# Altium project SOT-23,SOT-28,SOD-123.PrjPcb
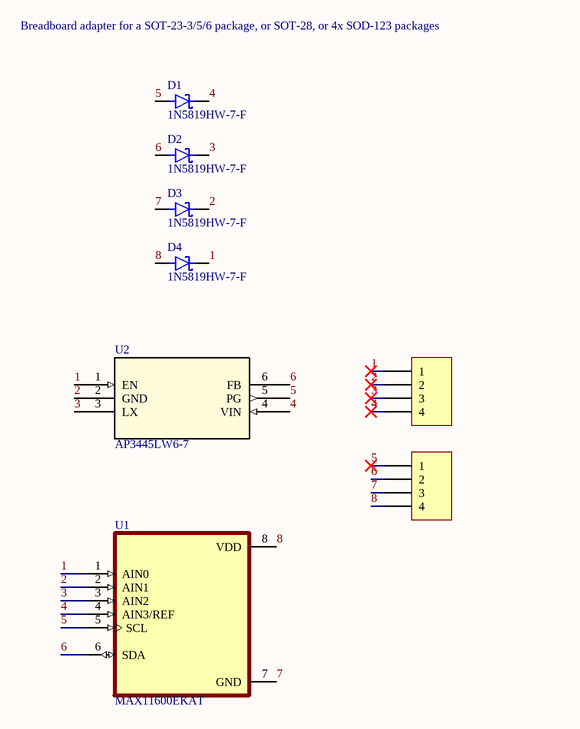
[diagram p0: Schematic.SchDoc]
1 sheet, 8 parts. Net scope: global (net labels, ports and power ports of the same name join across sheets).
Board file: PCB.PcbDoc

## Sheet Schematic.SchDoc
size A4

### Parts
D1  1N5819HW-7-F  [SOD3715X145N]
D2  1N5819HW-7-F  [SOD3715X145N]
D3  1N5819HW-7-F  [SOD3715X145N]
D4  1N5819HW-7-F  [SOD3715X145N]
P1  Header 4  [HDR1X4]  (value not drawn)
P2  Header 4  [HDR1X4]  (value not drawn)
U1  MAX11600EKAT  [SOT65P280X145-8N]
U2  AP3445LW6-7  [SOT26_AP3445_DIO]

### Nets
1: D4.C(K) P1.1 U1.1(AIN0) U2.1(EN)
2: D3.C(K) P1.2 U1.2(AIN1) U2.2(GND)
3: D2.C(K) P1.3 U1.3(AIN2) U2.3(LX)
4: D1.C(K) P1.4 U1.4(AIN3/REF) U2.4(VIN)
5: D1.A P2.1 U1.5(SCL) U2.5(PG)
6: D2.A P2.2 U1.6(SDA) U2.6(FB)
7: D3.A P2.3 U1.7(GND)
8: D4.A P2.4 U1.8(VDD)

### Notes on the sheet
- Breadboard adapter for a SOT-23-3/5/6 package, or SOT-28, or 4x SOD-123 packages

### Library data of the parts
D1-D4 = 1N5819HW-7-F: Diode Schottky 40 V 1A Surface Mount SOD-123; MF: Diodes Inc.; Value: *; SnapEDA_Link: https://www.snapeda.com/parts/1N5819HW-7-F/Diodes+Inc./view-part/?ref=snap; Purchase-URL: https://pricing.snapeda.com/search/part/1N5819HW-7-F/?ref=eda; Availability: In Stock; Price: None; Package: SOD-123 Fairchild Semiconductor; Check_prices: https://www.snapeda.com/parts/1N5819HW-7-F/Diodes+Inc./view-part/?ref=eda; MP: 1N5819HW-7-F
P1 P2 = Header 4: Header, 4-Pin; LatestRevisionDate: 17-Jul-2002; LatestRevisionNote: Re-released for DXP Platform.; Publisher: Altium Limited
U1 = MAX11600EKAT: 8 Bit Analog to Digital Converter 2, 4 Input 1 SAR SOT-23-8; MP: MAX11600EKA+T; MF: Maxim Integrated; SnapEDA_Link: https://www.snapeda.com/parts/MAX11600EKA+T/Maxim%20Integrated/view-part/609916/?ref=snap; Value: *; Availability: In Stock; Purchase-URL: https://pricing.snapeda.com/search/part/MAX11600EKA+T/?ref=eda; Check_prices: https://www.snapeda.com/parts/MAX11600EKA+T/Maxim%20Integrated/view-part/609916/?ref=eda; Package: SOT-8 Maxim; Price: None
U2 = AP3445LW6-7: No Description Available; Mfr_Name: Diodes Inc; Copyright: Copyright (C) 2024 Ultra Librarian. All rights reserved.; Manufacturer_Part_Number: AP3445LW6-7; RefDes: RefDes; Type: DEV